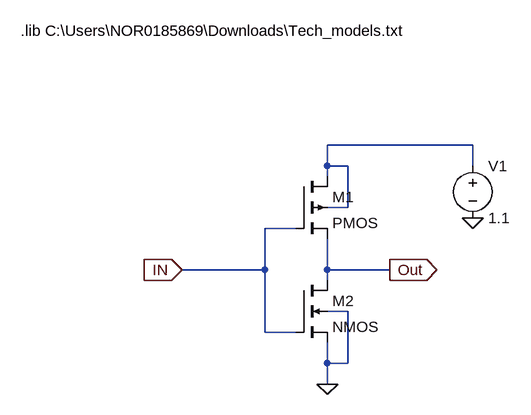
[diagram p0: schematic inverter.asc]
inverter.asc, the LTspice schematic file:
Version 4
SHEET 1 880 680
WIRE 560 144 336 144
WIRE 336 176 336 144
WIRE 368 176 336 176
WIRE 560 176 560 144
WIRE 336 192 336 176
WIRE 368 240 368 176
WIRE 368 240 336 240
WIRE 288 272 240 272
WIRE 240 336 240 272
WIRE 240 336 112 336
WIRE 336 336 336 288
WIRE 432 336 336 336
WIRE 336 352 336 336
WIRE 368 400 336 400
WIRE 240 432 240 336
WIRE 288 432 240 432
WIRE 336 480 336 448
WIRE 368 480 368 400
WIRE 368 480 336 480
WIRE 336 512 336 480
FLAG 560 256 0
FLAG 336 512 0
FLAG 112 336 IN
IOPIN 112 336 In
FLAG 432 336 Out
IOPIN 432 336 Out
SYMBOL pmos4 288 192 R0
SYMATTR InstName M1
SYMATTR Value2 l=32n w=64n
SYMBOL nmos4 288 352 R0
SYMATTR InstName M2
SYMATTR Value2 l=32n w=64n
SYMBOL voltage 560 160 R0
WINDOW 123 0 0 Left 0
WINDOW 39 0 0 Left 0
SYMATTR InstName V1
SYMATTR Value 1.1
TEXT -136 -32 Left 2 !.lib C:\\Users\\NOR0185869\\Downloads\\Tech_models.txt

The netlist it stands for:
* inverter.asc
M1 N001 IN Out N001 PMOS l=32n w=64n
M2 Out IN 0 0 NMOS l=32n w=64n
V1 N001 0 1.1
.model NMOS NMOS
.model PMOS PMOS
.lib standard.mos
.lib C:\Users\NOR0185869\Downloads\Tech_models.txt
.backanno
.end